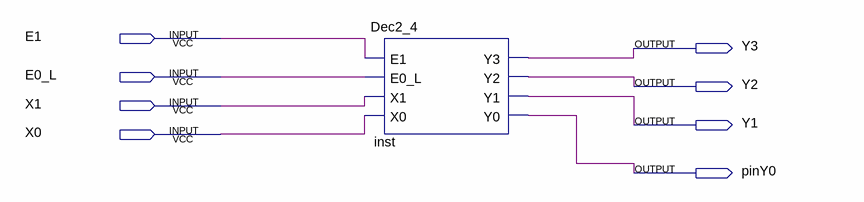
[diagram p0: schematic sheet]
// Quartus schematic Dec2_4_1.bdf as structural Verilog: 1 symbols, 8 pins
module Dec2_4_1 (
  input  E1,
  input  E0_L,
  input  X1,
  input  X0,
  output Y3,
  output Y2,
  output Y1,
  output pinY0
);

  Dec2_4 inst (.E1(E1), .E0_L(E0_L), .X1(X1), .X0(X0), .Y3(Y3), .Y2(Y2), .Y1(Y1), .Y0(pinY0));
endmodule
